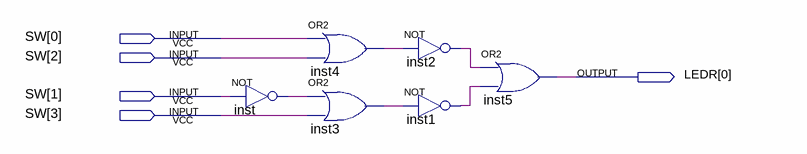
[diagram p0: schematic sheet]
// Quartus schematic Lab1Circuit2.bdf as structural Verilog: 6 symbols, 5 pins
module Lab1Circuit2 (
  input  [3:0] SW,
  output [0:0] LEDR
);

  wire inst1_out, inst2_out, inst3_out, inst4_out, inst_out;

  not inst (inst_out, SW[1]);
  or inst4 (inst4_out, SW[0], SW[2]);
  or inst3 (inst3_out, inst_out, SW[3]);
  not inst2 (inst2_out, inst4_out);
  not inst1 (inst1_out, inst3_out);
  or inst5 (LEDR[0], inst2_out, inst1_out);
endmodule
